# Altium schematic sheet MPU-Power.SchDoc
size B; DocumentNumber: 2; SheetNumber: 2
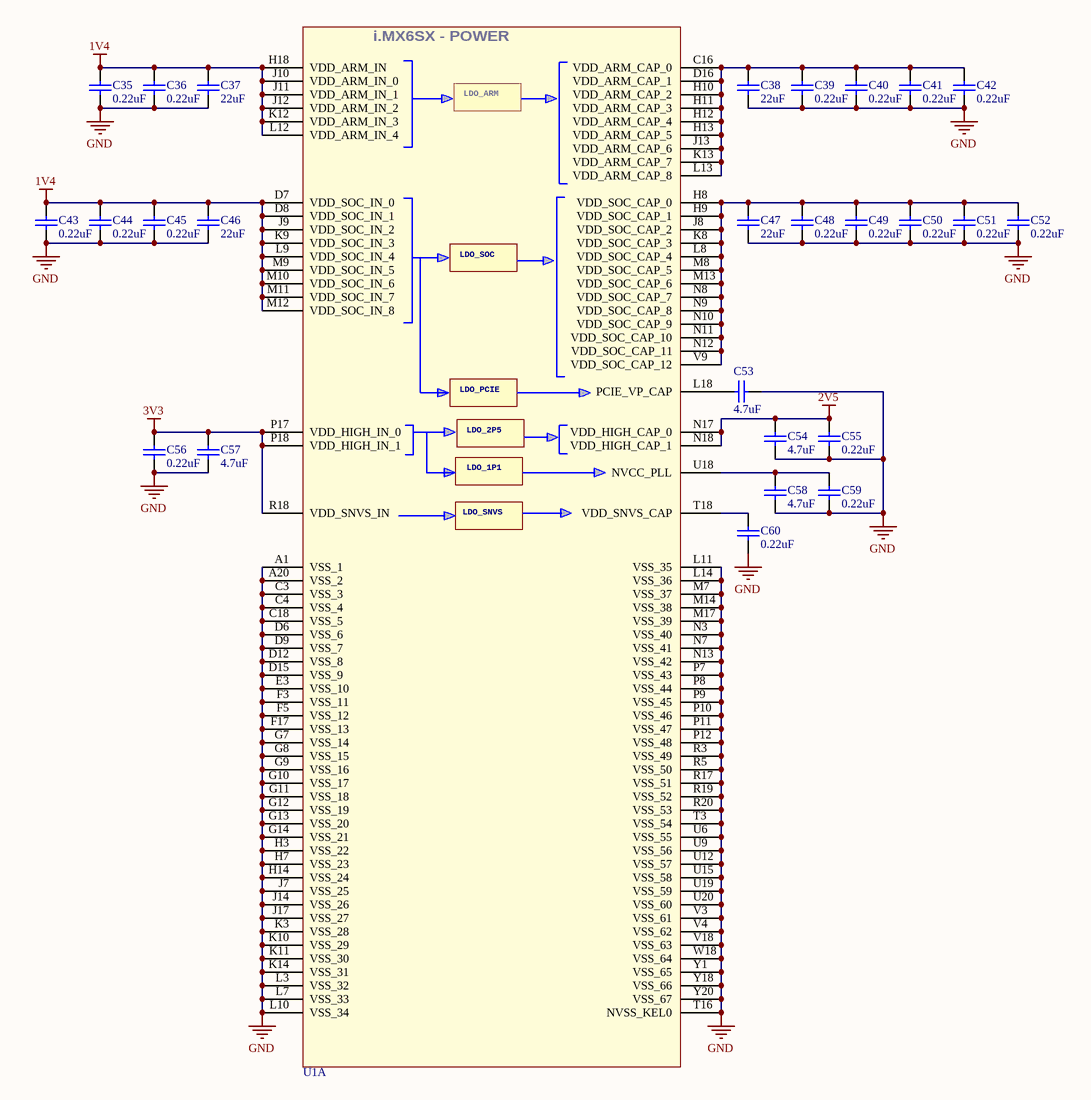
[diagram p0: MPU-Power.SchDoc]

## Parts
C35  value 0.22uF  [C0402[1005X55]]  (hidden comment: 0.22uF 6.3V 0402)
C36  value 0.22uF  [C0402[1005X55]]  (hidden comment: 0.22uF 6.3V 0402)
C37  value 22uF  [C0603[1608X92]]  (hidden comment: 22uF 6.3V 0603)
C38  value 22uF  [C0603[1608X92]]  (hidden comment: 22uF 6.3V 0603)
C39  value 0.22uF  [C0402[1005X55]]  (hidden comment: 0.22uF 6.3V 0402)
C40  value 0.22uF  [C0402[1005X55]]  (hidden comment: 0.22uF 6.3V 0402)
C41  value 0.22uF  [C0402[1005X55]]  (hidden comment: 0.22uF 6.3V 0402)
C42  value 0.22uF  [C0402[1005X55]]  (hidden comment: 0.22uF 6.3V 0402)
C43  value 0.22uF  [C0402[1005X55]]  (hidden comment: 0.22uF 6.3V 0402)
C44  value 0.22uF  [C0402[1005X55]]  (hidden comment: 0.22uF 6.3V 0402)
C45  value 0.22uF  [C0402[1005X55]]  (hidden comment: 0.22uF 6.3V 0402)
C46  value 22uF  [C0603[1608X92]]  (hidden comment: 22uF 6.3V 0603)
C47  value 22uF  [C0603[1608X92]]  (hidden comment: 22uF 6.3V 0603)
C48  value 0.22uF  [C0402[1005X55]]  (hidden comment: 0.22uF 6.3V 0402)
C49  value 0.22uF  [C0402[1005X55]]  (hidden comment: 0.22uF 6.3V 0402)
C50  value 0.22uF  [C0402[1005X55]]  (hidden comment: 0.22uF 6.3V 0402)
C51  value 0.22uF  [C0402[1005X55]]  (hidden comment: 0.22uF 6.3V 0402)
C52  value 0.22uF  [C0402[1005X55]]  (hidden comment: 0.22uF 6.3V 0402)
C53  value 4.7uF  [C0402[1005X55]]  (hidden comment: 4.7uF 6.3V 0402)
C54  value 4.7uF  [C0402[1005X55]]  (hidden comment: 4.7uF 6.3V 0402)
C55  value 0.22uF  [C0402[1005X55]]  (hidden comment: 0.22uF 6.3V 0402)
C56  value 0.22uF  [C0402[1005X55]]  (hidden comment: 0.22uF 6.3V 0402)
C57  value 4.7uF  [C0402[1005X55]]  (hidden comment: 4.7uF 6.3V 0402)
C58  value 4.7uF  [C0402[1005X55]]  (hidden comment: 4.7uF 6.3V 0402)
C59  value 0.22uF  [C0402[1005X55]]  (hidden comment: 0.22uF 6.3V 0402)
C60  value 0.22uF  [C0402[1005X55]]  (hidden comment: 0.22uF 6.3V 0402)
U1  MCIMX6X3EVO10AB  [BGA-400]  (value not drawn)  (part A of 12)

## Nets
1V4: C35.2 C36.2 C37.2 C43.2 C44.2 C45.2 C46.2 U1.D7(VDD_SOC_IN_0) U1.D8(VDD_SOC_IN_1) U1.H18(VDD_ARM_IN) U1.J9(VDD_SOC_IN_2) U1.J10(VDD_ARM_IN_0) U1.J11(VDD_ARM_IN_1) U1.J12(VDD_ARM_IN_2) U1.K9(VDD_SOC_IN_3) U1.K12(VDD_ARM_IN_3) U1.L9(VDD_SOC_IN_4) U1.L12(VDD_ARM_IN_4) U1.M9(VDD_SOC_IN_5) U1.M10(VDD_SOC_IN_6) U1.M11(VDD_SOC_IN_7) U1.M12(VDD_SOC_IN_8)
2V5: C54.2 C55.2 U1.N17(VDD_HIGH_CAP_0) U1.N18(VDD_HIGH_CAP_1)
3V3: C56.2 C57.2 U1.P17(VDD_HIGH_IN_0) U1.P18(VDD_HIGH_IN_1) U1.R18(VDD_SNVS_IN)
GND: C35.1 C36.1 C37.1 C38.1 C39.1 C40.1 C41.1 C42.1 C43.1 C44.1 C45.1 C46.1 C47.1 C48.1 C49.1 C50.1 C51.1 C52.1 C53.1 C54.1 C55.1 C56.1 C57.1 C58.1 C59.1 C60.1 U1.A1(VSS_1) U1.A20(VSS_2) U1.C3(VSS_3) U1.C4(VSS_4) U1.C18(VSS_5) U1.D6(VSS_6) U1.D9(VSS_7) U1.D12(VSS_8) U1.D15(VSS_9) U1.E3(VSS_10) U1.F3(VSS_11) U1.F5(VSS_12) U1.F17(VSS_13) U1.G7(VSS_14) U1.G8(VSS_15) U1.G9(VSS_16) U1.G10(VSS_17) U1.G11(VSS_18) U1.G12(VSS_19) U1.G13(VSS_20) U1.G14(VSS_21) U1.H3(VSS_22) U1.H7(VSS_23) U1.H14(VSS_24) U1.J7(VSS_25) U1.J14(VSS_26) U1.J17(VSS_27) U1.K3(VSS_28) U1.K10(VSS_29) U1.K11(VSS_30) U1.K14(VSS_31) U1.L3(VSS_32) U1.L7(VSS_33) U1.L10(VSS_34) U1.L11(VSS_35) U1.L14(VSS_36) U1.M7(VSS_37) U1.M14(VSS_38) U1.M17(VSS_39) U1.N3(VSS_40) U1.N7(VSS_41) U1.N13(VSS_42) U1.P7(VSS_43) U1.P8(VSS_44) U1.P9(VSS_45) U1.P10(VSS_46) U1.P11(VSS_47) U1.P12(VSS_48) U1.R3(VSS_49) U1.R5(VSS_50) U1.R17(VSS_51) U1.R19(VSS_52) U1.R20(VSS_53) U1.T3(VSS_54) U1.T16(NVSS_KEL0) U1.U6(VSS_55) U1.U9(VSS_56) U1.U12(VSS_57) U1.U15(VSS_58) U1.U19(VSS_59) U1.U20(VSS_60) U1.V3(VSS_61) U1.V4(VSS_62) U1.V18(VSS_63) U1.W18(VSS_64) U1.Y1(VSS_65) U1.Y18(VSS_66) U1.Y20(VSS_67)
NetC38_2: C38.2 C39.2 C40.2 C41.2 C42.2 U1.C16(VDD_ARM_CAP_0) U1.D16(VDD_ARM_CAP_1) U1.H10(VDD_ARM_CAP_2) U1.H11(VDD_ARM_CAP_3) U1.H12(VDD_ARM_CAP_4) U1.H13(VDD_ARM_CAP_5) U1.J13(VDD_ARM_CAP_6) U1.K13(VDD_ARM_CAP_7) U1.L13(VDD_ARM_CAP_8)
NetC47_2: C47.2 C48.2 C49.2 C50.2 C51.2 C52.2 U1.H8(VDD_SOC_CAP_0) U1.H9(VDD_SOC_CAP_1) U1.J8(VDD_SOC_CAP_2) U1.K8(VDD_SOC_CAP_3) U1.L8(VDD_SOC_CAP_4) U1.M8(VDD_SOC_CAP_5) U1.M13(VDD_SOC_CAP_6) U1.N8(VDD_SOC_CAP_7) U1.N9(VDD_SOC_CAP_8) U1.N10(VDD_SOC_CAP_9) U1.N11(VDD_SOC_CAP_10) U1.N12(VDD_SOC_CAP_11) U1.V9(VDD_SOC_CAP_12)
NetC53_2: C53.2 U1.L18(PCIE_VP_CAP)
NetC58_2: C58.2 C59.2 U1.U18(NVCC_PLL)
NetC60_2: C60.2 U1.T18(VDD_SNVS_CAP)

## Notes on the sheet
- (in symbol MCIMX6X3EVO10AB, part A) i.MX6SX - POWER; LDO_ARM; LDO_SOC; LDO_PCIE; LDO_2P5; LDO_1P1; LDO_SNVS

## Library data of the parts
C35 C36 C39-C45 C48-C52 C55 C56 C59 C60 = CAP_0.22uF_6.3V_0402_10%: 0.22uF 6.3V 10% 0402 (1005 Metric); PartNumber: JMK105BJ224KV-F; Manufacturer: Taiyo Yuden; Mounting Technology: Surface Mount; PackageReference: 0402; PackageDescription: 0402 (1005 Metric); Voltage: 6.3V; Tolerance: 10%
C37 C38 C46 C47 = CAP_22uF_6.3V_0603_10%: 22uF 6.3V 10% 0603 (1608 Metric); PartNumber: GRT188R60J226ME13D; Manufacturer: Murata; Mounting Technology: Surface Mount; PackageReference: 0603; PackageDescription: 0603 (1608 Metric); Voltage: 6.3V; Tolerance: 10%
C53 C54 C57 C58 = CAP_4.7uF_6.3V_0402_20%: 4.7uF 6.3V 20% 0402 (1005 Metric); PartNumber: GRM155R60J475ME47D; Manufacturer: Murata; Mounting Technology: Surface Mount; PackageReference: 0402; PackageDescription: 0402 (1005 Metric); Voltage: 6.3V; Tolerance: 20%
U1 = MCIMX6X3EVO10AB: IC MPU I.MX6SX 1GHZ 400MAPBGA; Manufacturer: NXP; PartNumber: MCIMX6X3EVO10AB; Mounting Technology: Surface Mount; PackageReference: BGA-400